# EAGLE design Board Schematic (EAGLE 7.5.0)
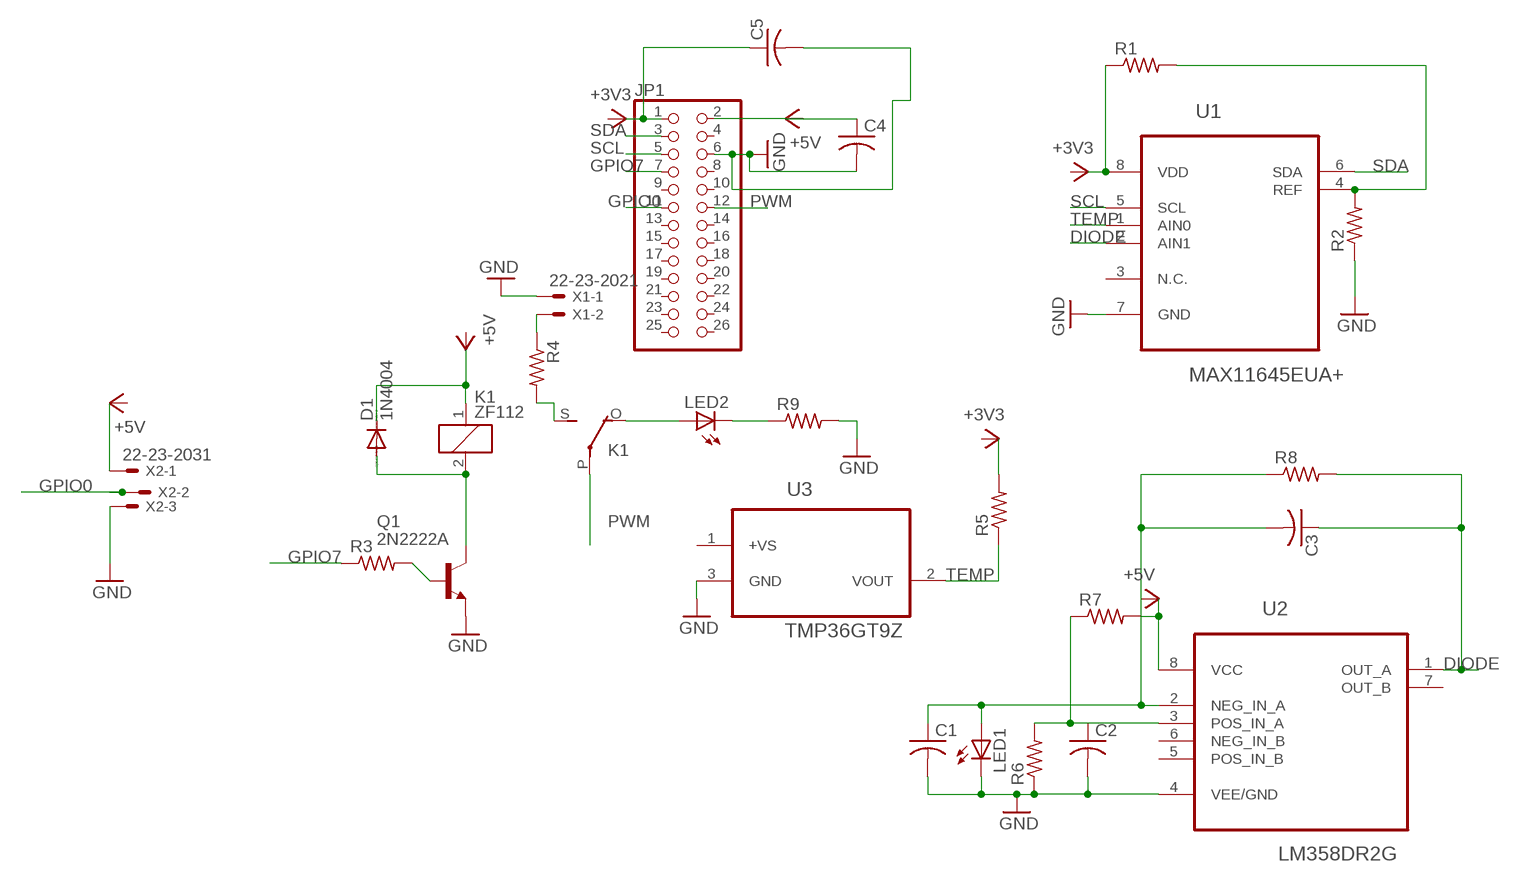
[diagram p0: schematic, sheet 1]

## Parts
C1  C-USC1206  [C1206]
C2  C-USC1206  [C1206]
C3  C-USC1206  [C1206]
C4  C-USC1206  [C1206]
C5  C-USC1206  [C1206]
D1  1N4004  [DO41-10]
JP1  PINHD-2X13  [2X13]
K1  ZF112  [ZF112]
LED1  LED5MM  [LED5MM]
LED2  LED5MM  [LED5MM]
Q1  2N2222A  [TO18]
R1  R-US_R1206  [R1206]
R2  R-US_R1206  [R1206]
R3  R-US_R1206  [R1206]
R4  R-US_R1206  [R1206]
R5  R-US_R1206  [R1206]
R6  R-US_R1206  [R1206]
R7  R-US_R1206  [R1206]
R8  R-US_R1206  [R1206]
R9  R-US_R1206  [R1206]
U1  MAX11645EUA+  [SOP65P490X110-8N]
U2  LM358DR2G  [SOIC127P600X175-8N]
U3  TMP36GT9Z  [TO127P254X533-3P]
X1  22-23-2021  [22-23-2021]
X2  22-23-2031  [22-23-2031]

## Nets
3V3: C5.1 JP1.1 R1.1 R5.2 U1.8(VDD)
+5V: C4.1 D1.C JP1.2 K1.1 R7.2 U2.8(VCC) X2.1
DIODE: C3.1 R8.2 U1.2(AIN1) U2.1(OUT_A)
GND: C1.2 C2.2 C4.2 C5.2 JP1.6 LED1.K(C) Q1.1(E) R2.1 R6.1 R9.2 U1.7(GND) U2.4(VEE/GND) U3.3(GND) X1.1 X2.3
GPIO0: JP1.11 X2.2
GPIO7: JP1.7 R3.1
N$1: R1.2 R2.2 U1.4(REF)
N$2: R4.1 X1.2
N$3: C1.1 C3.2 LED1.A R8.1 U2.2(NEG_IN_A)
N$4: C2.1 R6.2 R7.1 U2.3(POS_IN_A)
N$5: K1.O(2:O) LED2.A
N$6: D1.A K1.2 Q1.3(C)
N$7: Q1.2(B) R3.2
N$8: K1.S(2:S) R4.2
N$9: LED2.K(C) R9.1
PWM: JP1.12 K1.P(2:P)
SCL: JP1.5 U1.5(SCL)
SDA: JP1.3 U1.6(SDA)
TEMP: R5.1 U1.1(AIN0) U3.2(VOUT)
Unconnected: JP1.4 JP1.8 JP1.9 JP1.10 JP1.13 JP1.14 JP1.15 JP1.16 JP1.17 JP1.18 JP1.19 JP1.20 JP1.21 JP1.22 JP1.23 JP1.24 JP1.25 JP1.26 U1.3(N.C.) U2.5(POS_IN_B) U2.6(NEG_IN_B) U2.7(OUT_B)

## Power pins joined to a net without a drawn wire
+VS: U3.1(+VS)

## Library data of the parts
C1-C5 = resistor:C-US: CAPACITOR, American symbol
D1 = diode:1N4004: DIODE general purpose rectifier, 1 A
JP1 = pinhead:PINHD-2X13: PIN HEADER
K1 = relay:ZF112: RELAY 1 x switch; OC_FARNELL: unknown; OC_NEWARK: unknown
LED1 = ledOS:LED: LED OSRAM: - CHIPLED LG R971, LG N971, LY N971, LG Q971, LY Q971, LO R971, LY R971 LH N974, LH R974 LS Q976, LO Q976, LY Q976 LO Q996 - Hyper CHIPLED LW Q18S LB Q993, LB Q99A, LB R99A - SideLED LS A670, LO A670, LY A670, LG A670, LP A670 LB A673, LV A673, LT A673, LW A673 LH A674 LY A675 LS A676, LA A676, LO A676, LY A676, LW A676 LS A679, LY A679, LG A679 - Hyper Micro SIDELED® LS Y876, LA Y876, LO Y876, LY Y876 LT Y87S - SmartLED LW L88C, LW L88S LB L89C, LB L89S, LG L890 LS L89K, LO L89K, LY L89K LS L896, LA L896, LO L896, LY L896 - TOPLED LS T670, LO T670, LY T670, LG T670, LP T670 LSG T670, LSP T670, LSY T670, LOP T670, LYG T670 LG T671, LOG T671, LSG T671 LB T673, LV T673, LT T673, LW T673 LH T674 LS T676, LA T676, LO T676, LY T676, LB T676, LH T676, LSB T676, LW T676 LB T67C, LV T67C, LT T67C, LS T67K, LO T67K, LY T67K, LW E67C LS E67B, LA E67B, LO E67B, LY E67B, LB E67C, LV E67C, LT E67C LW T67C LS T679, LY T679, LG T679 LS T770, LO T770, LY T770, LG T770, LP T770 LB T773, LV T773, LT T773, LW T773 LH T774 LS E675, LA E675, LY E675, LS T675 LS T776, LA T776, LO T776, LY T776, LB T776 LHGB T686 LT T68C, LB T68C - Hyper Mini TOPLED® LB M676 - Mini TOPLED Santana® LG M470 LS M47K, LO M47K, LY M47K Source: http://www.osram.convergy.de LUXEON: - LUMILED® LXK2-PW12-R00, LXK2-PW12-S00, LXK2-PW14-U00, LXK2-PW14-V00 LXK2-PM12-R00, LXK2-PM12-S00, LXK2-PM14-U00 LXK2-PE12-Q00, LXK2-PE12-R00, LXK2-PE12-S00, LXK2-PE14-T00, LXK2-PE14-U00 LXK2-PB12-K00, LXK2-PB12-L00, LXK2-PB12-M00, LXK2-PB14-N00, LXK2-PB14-P00, LXK2-PB14-Q00 LXK2-PR12-L00, LXK2-PR12-M00, LXK2-PR14-Q00, LXK2-PR14-R00 LXK2-PD12-Q00, LXK2-PD12-R00, LXK2-PD12-S00 LXK2-PH12-R00, LXK2-PH12-S00 LXK2-PL12-P00, LXK2-PL12-Q00, LXK2-PL12-R00 Source: www.luxeon.com KINGBRIGHT: KA-3528ASYC Source: www.kingbright.com
LED2 = led:LED: LED OSRAM: - CHIPLED LG R971, LG N971, LY N971, LG Q971, LY Q971, LO R971, LY R971 LH N974, LH R974 LS Q976, LO Q976, LY Q976 LO Q996 - Hyper CHIPLED LW Q18S LB Q993, LB Q99A, LB R99A - SideLED LS A670, LO A670, LY A670, LG A670, LP A670 LB A673, LV A673, LT A673, LW A673 LH A674 LY A675 LS A676, LA A676, LO A676, LY A676, LW A676 LS A679, LY A679, LG A679 - Hyper Micro SIDELED® LS Y876, LA Y876, LO Y876, LY Y876 LT Y87S - SmartLED LW L88C, LW L88S LB L89C, LB L89S, LG L890 LS L89K, LO L89K, LY L89K LS L896, LA L896, LO L896, LY L896 - TOPLED LS T670, LO T670, LY T670, LG T670, LP T670 LSG T670, LSP T670, LSY T670, LOP T670, LYG T670 LG T671, LOG T671, LSG T671 LB T673, LV T673, LT T673, LW T673 LH T674 LS T676, LA T676, LO T676, LY T676, LB T676, LH T676, LSB T676, LW T676 LB T67C, LV T67C, LT T67C, LS T67K, LO T67K, LY T67K, LW E67C LS E67B, LA E67B, LO E67B, LY E67B, LB E67C, LV E67C, LT E67C LW T67C LS T679, LY T679, LG T679 LS T770, LO T770, LY T770, LG T770, LP T770 LB T773, LV T773, LT T773, LW T773 LH T774 LS E675, LA E675, LY E675, LS T675 LS T776, LA T776, LO T776, LY T776, LB T776 LHGB T686 LT T68C, LB T68C - Hyper Mini TOPLED® LB M676 - Mini TOPLED Santana® LG M470 LS M47K, LO M47K, LY M47K Source: http://www.osram.convergy.de LUXEON: - LUMILED® LXK2-PW12-R00, LXK2-PW12-S00, LXK2-PW14-U00, LXK2-PW14-V00 LXK2-PM12-R00, LXK2-PM12-S00, LXK2-PM14-U00 LXK2-PE12-Q00, LXK2-PE12-R00, LXK2-PE12-S00, LXK2-PE14-T00, LXK2-PE14-U00 LXK2-PB12-K00, LXK2-PB12-L00, LXK2-PB12-M00, LXK2-PB14-N00, LXK2-PB14-P00, LXK2-PB14-Q00 LXK2-PR12-L00, LXK2-PR12-M00, LXK2-PR14-Q00, LXK2-PR14-R00 LXK2-PD12-Q00, LXK2-PD12-R00, LXK2-PD12-S00 LXK2-PH12-R00, LXK2-PH12-S00 LXK2-PL12-P00, LXK2-PL12-Q00, LXK2-PL12-R00 Source: www.luxeon.com KINGBRIGHT: KA-3528ASYC Source: www.kingbright.com
Q1 = transistor-npn:2N2222*: NPN Transistor
R1-R9 = resistor:R-US_: RESISTOR, American symbol
U1 = Maxim_By_element14_Batch_1:MAX11645EUA+: ADC; MPN: MAX11645EUA+; OC_FARNELL: -; OC_NEWARK: 71R9159; PACKAGE: SOP-8; SUPPLIER: Maxim
U2 = ON Semiconductor_By_element14_Batch_1:LM358DR2G: Single Supply Dual Operational Amplifiers; MPN: LM358DR2G; OC_FARNELL: 1262834; OC_NEWARK: 83H7264; PACKAGE: SOIC-8; SUPPLIER: ON SEMICONDUCTOR
U3 = ADI-Phase-2:TMP36GT9Z: Voltage Output Temperature Sensors; MPN: TMP36GT9Z; OC_FARNELL: 1438760; OC_NEWARK: 19M9015; PACKAGE: TO-92; SUPPLIER: Analog Devices
X1 = con-molex:22-23-2021: .100" (2.54mm) Center Header - 2 Pin; MF: MOLEX; MPN: 22-23-2021; OC_FARNELL: 1462926; OC_NEWARK: 25C3832
X2 = con-molex:22-23-2031: .100" (2.54mm) Center Header - 3 Pin; MF: MOLEX; MPN: 22-23-2031; OC_FARNELL: 1462950; OC_NEWARK: 30C0862

## Module TEMPSENS
Ports: 

### Library data of the parts

## Board
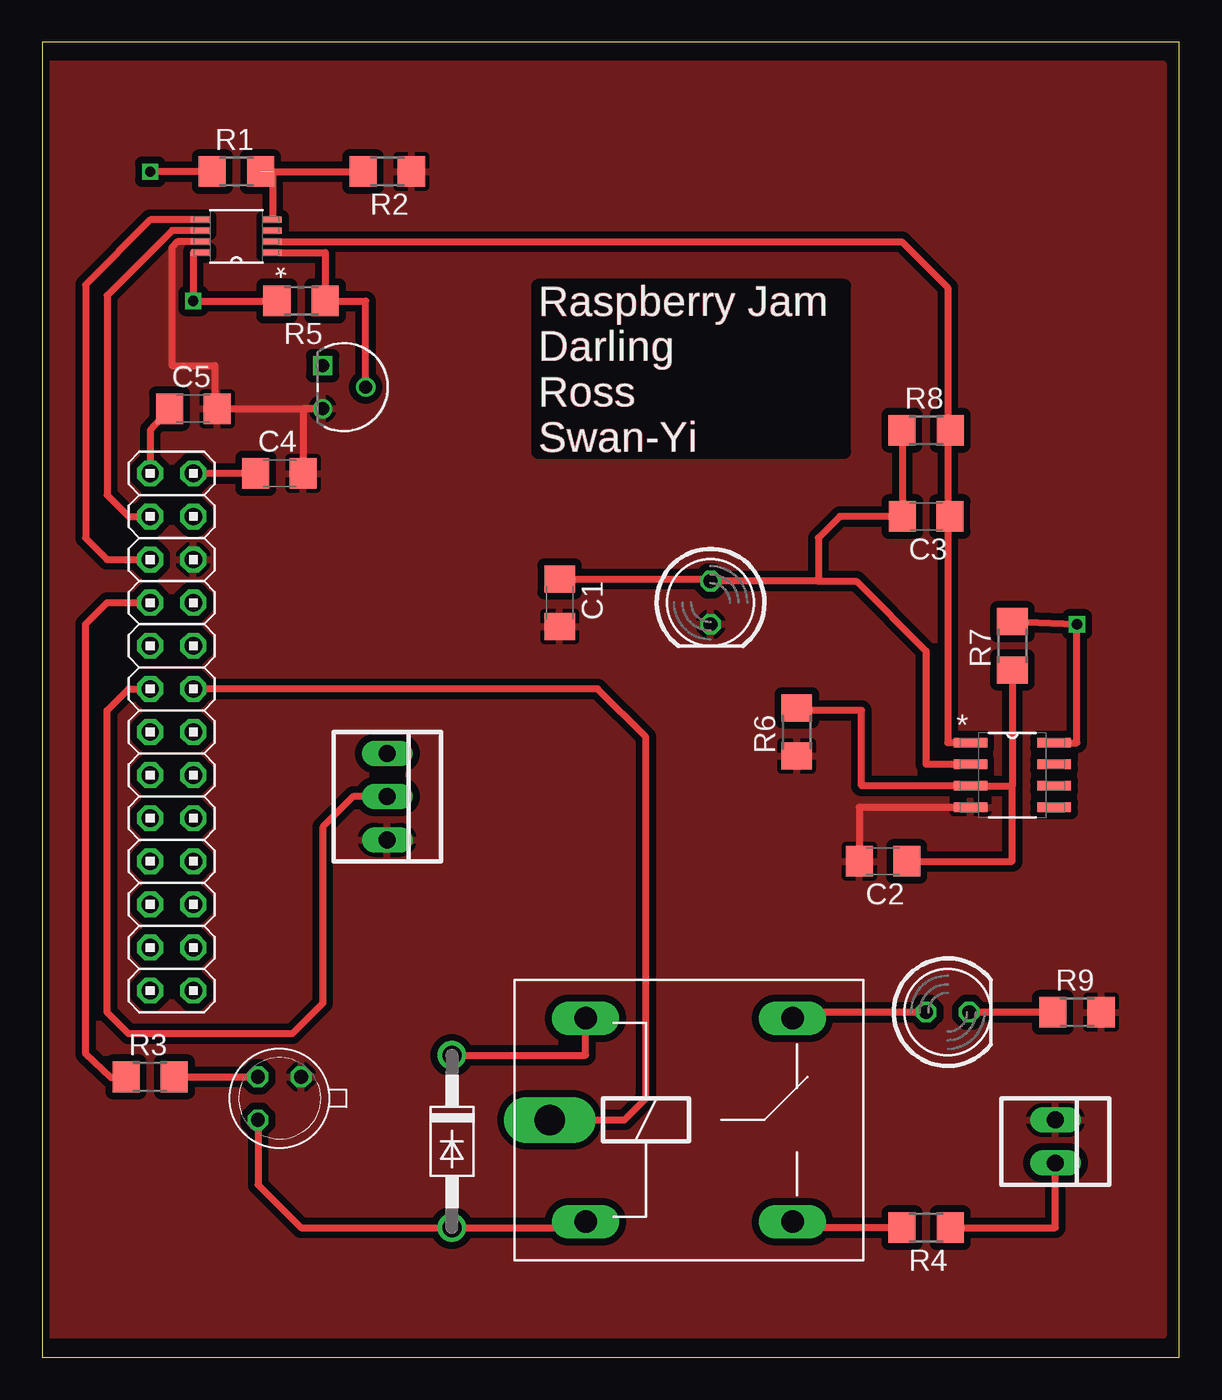
[diagram p1: board, top side]
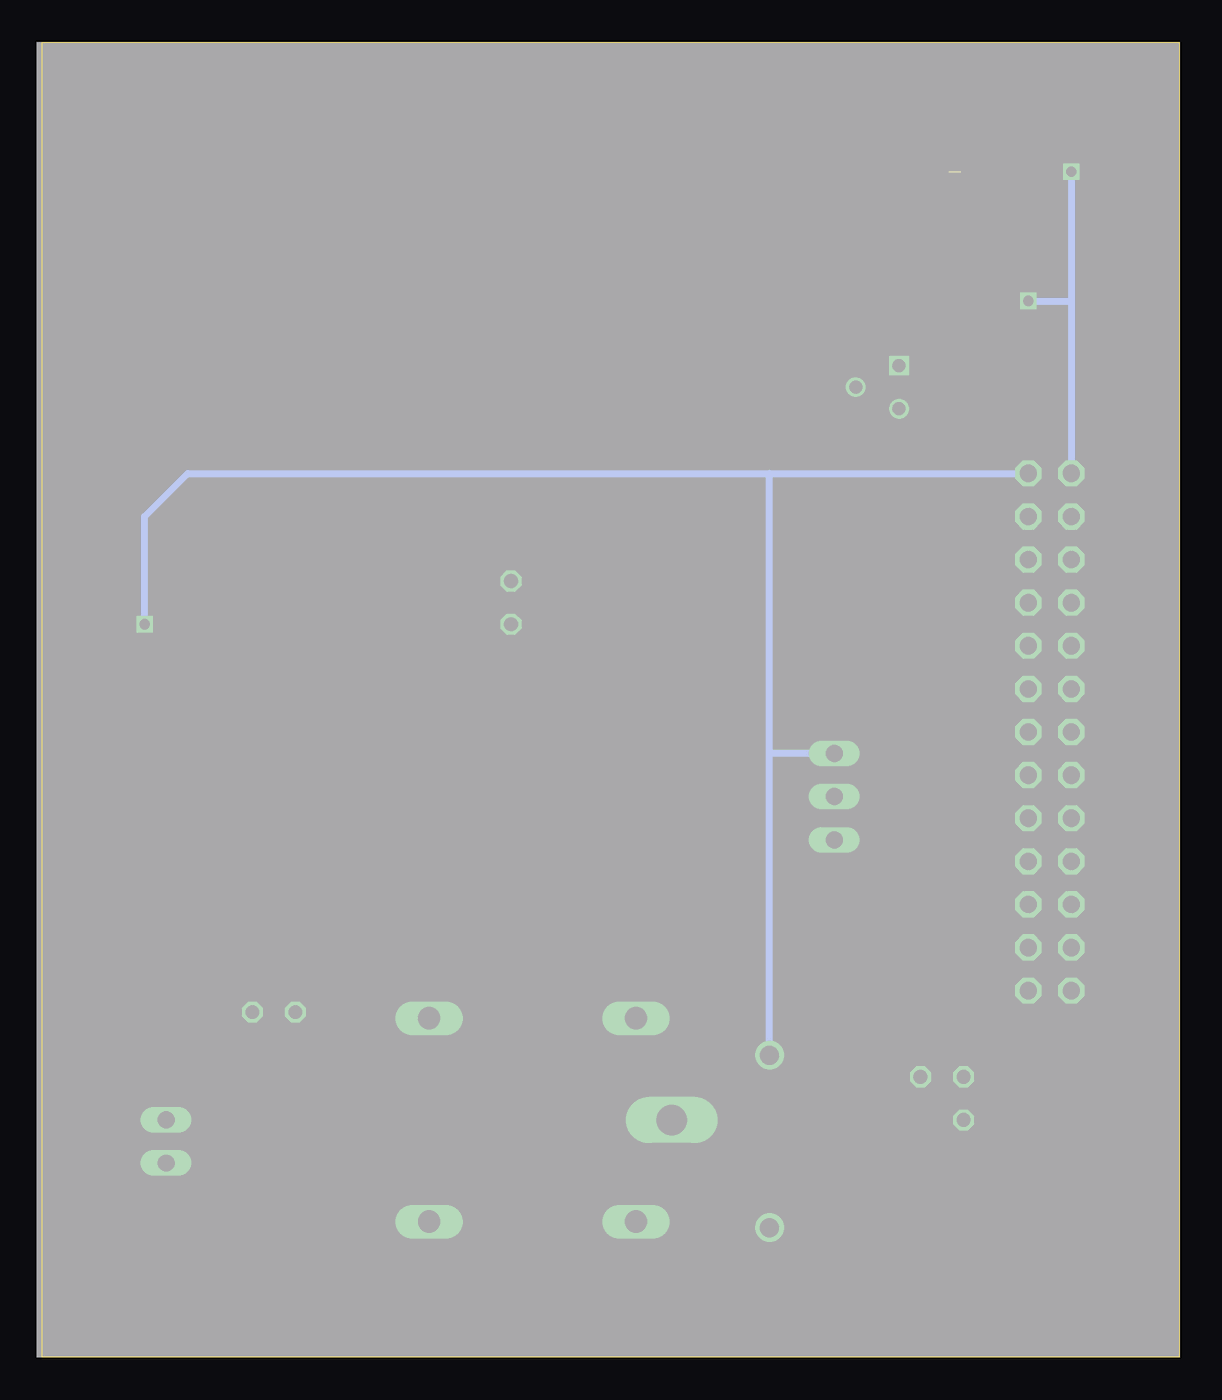
[diagram p2: board, bottom side, seen from below]

Size 66.98 x 77.46 mm. Coordinates in mm from the lower left corner, seen from the top.
Outline: 0,0 66.98,0 66.98,77.46 0,77.46 0,0
Copper layers (1*16): Top 0.0356mm / dielectric 1.5011mm / Bottom 0.0356mm
Design rules "LaenPCBOrder": minimum track width 6mil, minimum drill 13mil, track to track 6mil, track to pad 6mil, pad to pad 6mil, via to via 6mil, smd to smd 6mil, copper to edge 15mil, drill to drill 6mil, minimum pad ring 7mil, minimum via ring 7mil, stop-mask expansion 3mil, vias tented up to drill 0mil, thermal gap 10mil

### Footprints (pad centres in the part's own frame; a part is rotated, then mirrored left to right if it is on the bottom)
C1206 = smd 1.6 x 1.8: 1 -1.4,0; 2 1.4,0
DO41-10 = drill 1.118: A 5.08,0; C -5.08,0
2X13 = drill 1.016 octagon: 1 -15.24,-1.27; 2 -15.24,1.27; 3 -12.7,-1.27; 4 -12.7,1.27; 5 -10.16,-1.27; 6 -10.16,1.27; 7 -7.62,-1.27; 8 -7.62,1.27; 9 -5.08,-1.27; 10 -5.08,1.27; 11 -2.54,-1.27; 12 -2.54,1.27; 13 0,-1.27; 14 0,1.27; 15 2.54,-1.27; 16 2.54,1.27; 17 5.08,-1.27; 18 5.08,1.27; 19 7.62,-1.27; 20 7.62,1.27; 21 10.16,-1.27; 22 10.16,1.27; 23 12.7,-1.27; 24 12.7,1.27; 25 15.24,-1.27; 26 15.24,1.27
ZF112 = drill 1.321 long: 1 -6.096,5.994; 2 -6.096,-5.994; O 6.096,5.994; S 6.096,-5.994 | drill 1.803 long: P -8.204,0
LED5MM = drill 0.813 octagon: A -1.27,0; K 1.27,0
TO18 = drill 0.813 octagon: 1 -1.27,-1.27; 2 1.27,-1.27; 3 1.27,1.27
R1206 = smd 1.6 x 1.803: 1 -1.422,0; 2 1.422,0
SOP65P490X110-8N = smd 1.067 x 0.356: 1 -2.134,0.965; 2 -2.134,0.33; 3 -2.134,-0.33; 4 -2.134,-0.965; 5 2.134,-0.965; 6 2.134,-0.33; 7 2.134,0.33; 8 2.134,0.965
SOIC127P600X175-8N = smd 1.981 x 0.559: 1 -2.464,1.905; 2 -2.464,0.635; 3 -2.464,-0.635; 4 -2.464,-1.905; 5 2.464,-1.905; 6 2.464,-0.635; 7 2.464,0.635; 8 2.464,1.905
TO127P254X533-3P = drill 0.762 square: 1 -2.54,-2.54 | drill 0.762: 2 -1.27,0; 3 0,-2.54
22-23-2021 = drill 1 long: 1 -1.27,0; 2 1.27,0
22-23-2031 = drill 1 long: 1 -2.54,0; 2 0,0; 3 2.54,0

### Placement (x,y rotation side)
C1  30.48,44.45 270 top
C2  49.53,29.21 180 top
C3  52.07,49.53 180 top
C4  13.97,52.07 0 top
C5  8.89,55.88 0 top
D1  24.13,12.7 270 top
JP1  7.62,36.83 270 top
K1  38.1,13.97 0 top
LED1  39.37,44.45 270 top
LED2  53.34,20.32 0 top
Q1  13.97,15.24 180 top
R1  11.43,69.85 0 top
R2  20.32,69.85 180 top
R3  6.35,16.51 0 top
R4  52.07,7.62 180 top
R5  15.24,62.23 180 top
R6  44.45,36.83 90 top
R7  57.15,41.91 90 top
R8  52.07,54.61 0 top
R9  60.96,20.32 0 top
U1  11.43,66.04 180 top
U2  57.15,34.29 0 top
U3  19.05,55.88 270 top
X1  59.69,12.7 270 top
X2  20.32,33.02 270 top

### Tracks (layer width: path | path; a pad name or v marks a point on that pad's centre or on a via)
3V3  (via drill 0.6)
  Top 0.406: R1.1 v6.35,69.85 | C5.1 6.35,54.61 JP1.1 | U1.8 8.89,65.07 v8.89,62.23 R5.2
  Bottom 0.406: v8.89,62.23 6.35,62.23 | 6.35,62.23 JP1.1 | v6.35,69.85 6.35,62.23
+5V  (via drill 0.6)
  Top 0.406: U2.8 60.96,36.2 v60.96,43.18 R7.2 | C4.1 JP1.2 | D1.C 32,17.78 K1.1
  Bottom 0.406: D1.C 24.13,35.56 | 24.13,35.56 24.13,52.07 | 24.13,52.07 JP1.2 | v60.96,43.18 60.96,49.53 58.42,52.07 24.13,52.07 | X2.1 24.13,35.56
DIODE
  Top 0.406: 53.34,49.53 53.34,36.2 U2.1 | R8.2 53.34,54.61 | 53.34,54.61 53.34,49.53 | C3.1 53.34,49.53 | U1.2 50.63,65.71 53.34,63 53.34,54.61
GND
  Top 0.406: U2.4 48.13,32.38 C2.2 | U1.7 7.95,65.71 7.62,65.38 7.62,58.42 10.16,58.42 10.16,55.88 C5.2 U3.3 15.37,55.88 C4.2
  pour Top (isolate 0.406): 0,76.2 66.04,76.2 66.04,1.27 0,1.27
GPIO0
  Top 0.406: X2.2 18.31,33.02 16.51,31.22 16.51,20.85 14.71,19.05 5.08,19.05 3.81,20.32 3.81,38.1 5.08,39.37 JP1.11
GPIO7
  Top 0.406: R3.1 4.05,16.45 2.54,17.87 2.54,43.18 3.81,44.45 JP1.7
N$1  (1 unrouted)
  Top 0.406: U1.4 13.56,69.85 R2.2
N$2
  Top 0.406: R4.1 59.69,7.62 X1.2
N$3
  Top 0.406: 45.72,45.72 47.96,45.72 52.07,41.61 52.07,34.93 U2.2 | R8.1 50.67,54.61 C3.2 46.99,49.53 45.72,48.26 45.72,45.72 | C1.1 39.37,45.85 LED1.A 45.72,45.72
N$4
  Top 0.406: R7.1 57.15,33.66 | 57.15,33.66 U2.3 48.26,33.66 48.26,38.1 44.45,38.1 R6.2 | C2.1 57.15,29.21 57.15,33.66
N$5
  Top 0.406: LED2.A 44.2,20.32 K1.O
N$6
  Top 0.406: Q1.3 12.7,10.16 15.24,7.62 D1.A 32,7.62 K1.2
N$7
  Top 0.406: R3.2 Q1.2
N$8
  Top 0.406: R4.2 44.2,7.62 K1.S
N$9
  Top 0.406: R9.1 LED2.K
PWM
  Top 0.406: K1.P 34.29,13.97 35.56,15.24 35.56,36.53 32.72,39.37 JP1.12
SCL
  Top 0.406: U1.5 6.36,67 2.54,63.18 2.54,48.26 3.81,46.99 JP1.5
SDA
  Top 0.406: U1.6 7.63,66.37 3.81,62.55 3.81,50.8 5.08,49.53 JP1.3
TEMP
  Top 0.406: U1.1 16.66,65.07 R5.1 19.05,62.23 U3.2

### Text on the board
Top: Raspberry Jam / Darling / Ross / Swan-Yi | Raspberry Jam / Darling / Ross / Swan-Yi | Raspberry Jam / Darling / Ross / Swan-Yi | Raspberry Jam / Darling / Ross / Swan-Yi | Raspberry Jam / Darling / Ross / Swan-Yi | Raspberry Jam / Darling / Ross / Swan-Yi
tNames: Raspberry Jam / Darling / Ross / Swan-Yi